# Altium schematic sheet MISC.SchDoc: Network Module
size 431 x 279 mm; DrawnBy: Bin Xiao; Organization: RYSE Inc.
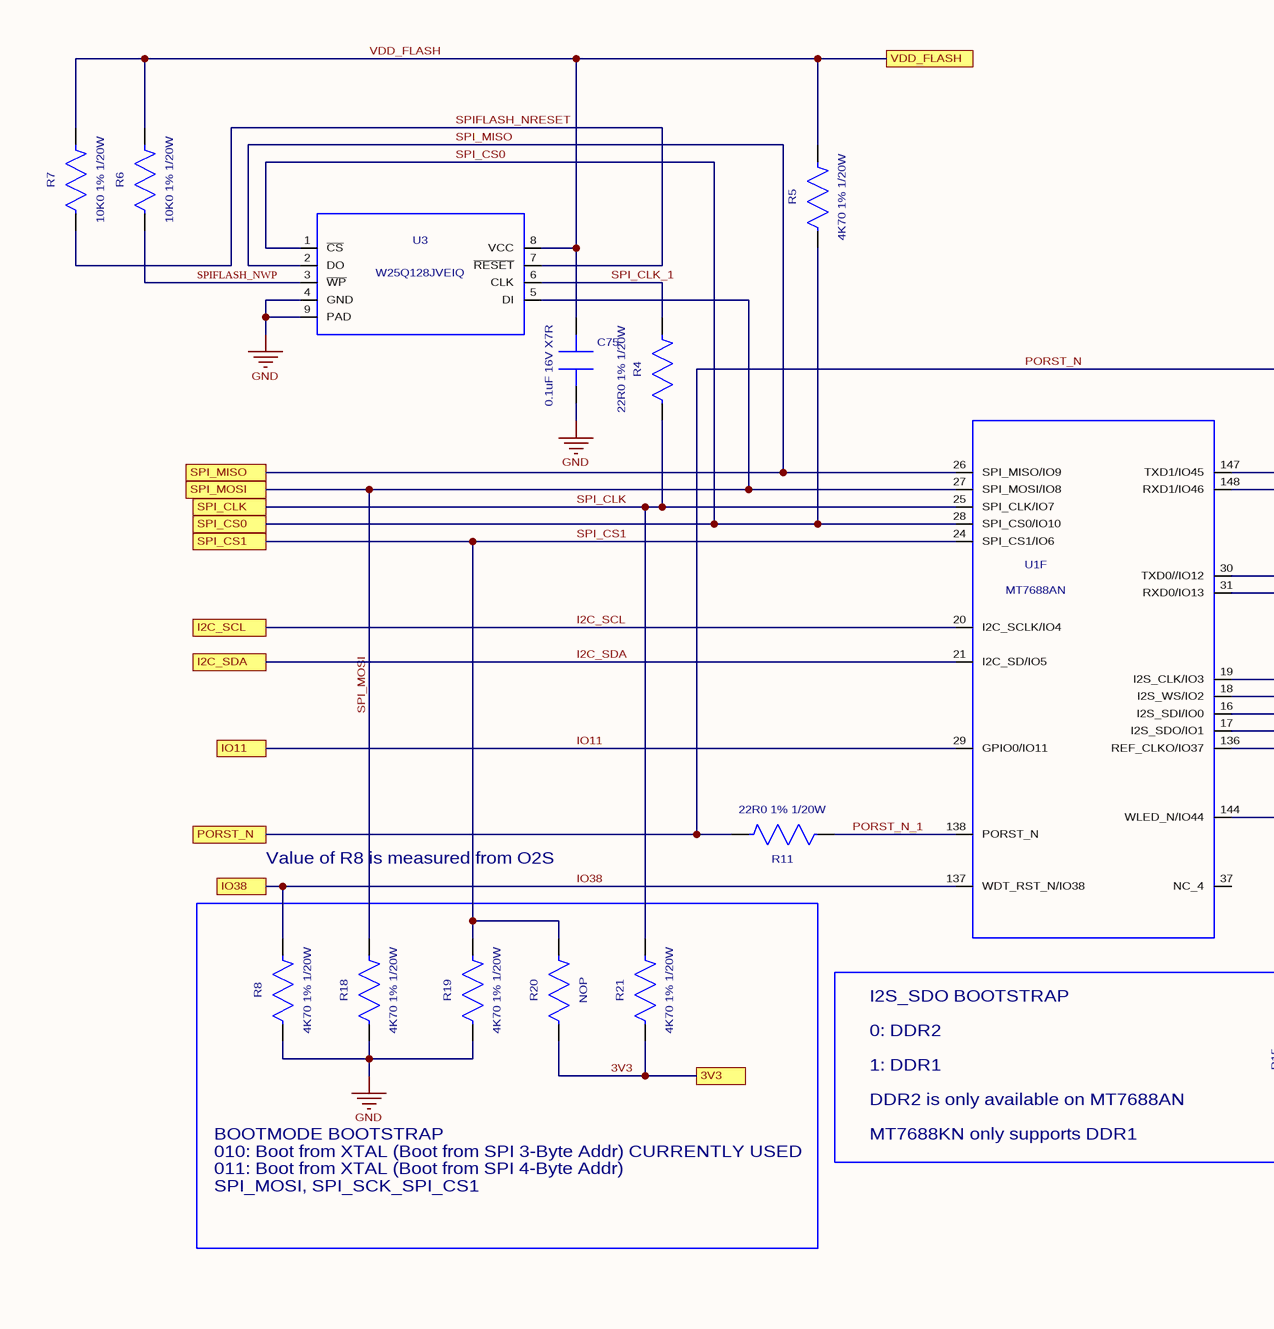
[diagram p0: MISC.SchDoc, left]
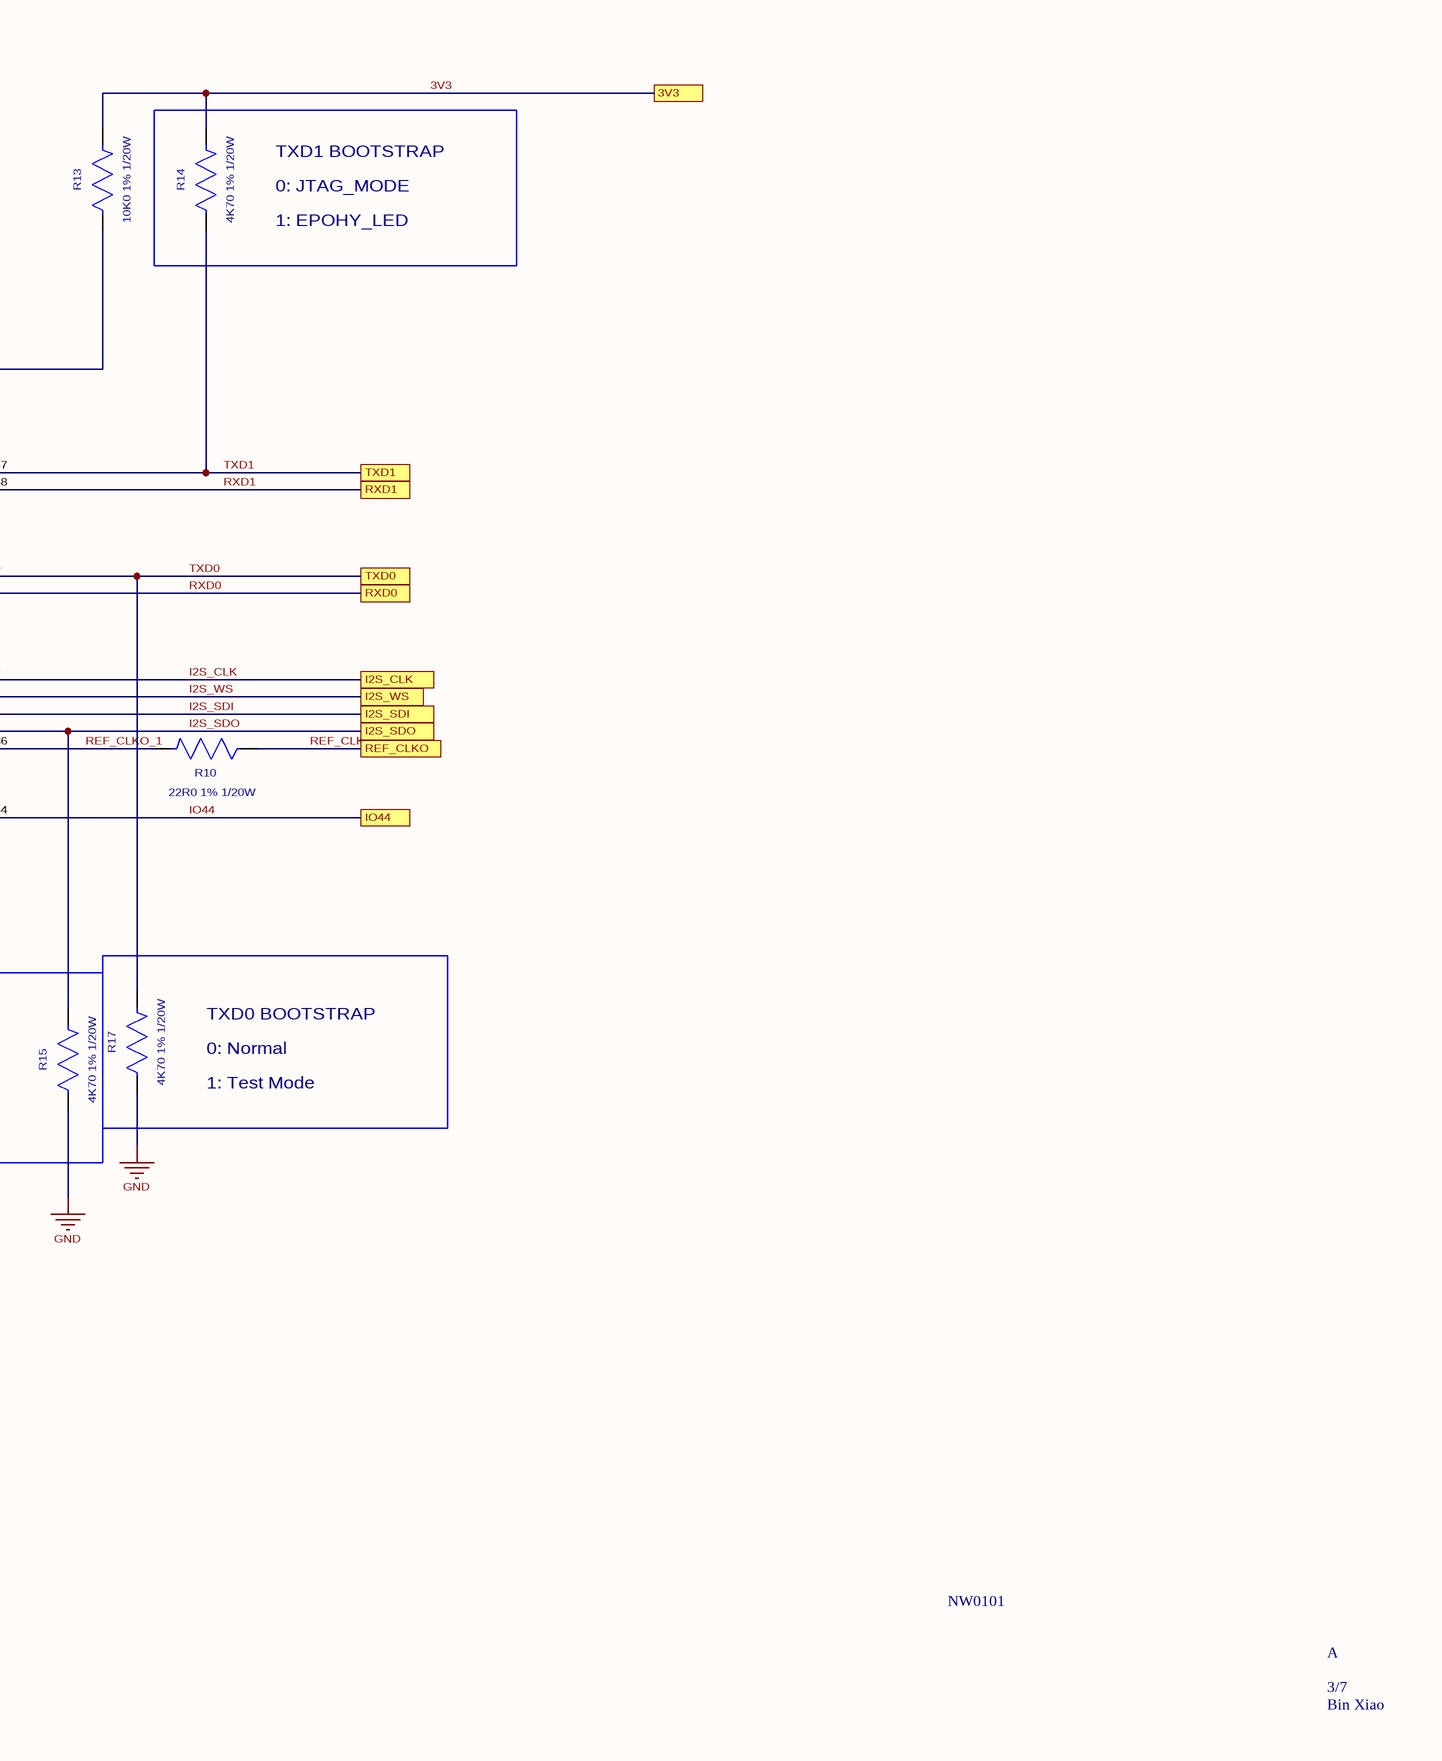
[diagram p1: MISC.SchDoc, right]

## Parts
C75  value 0.1uF 16V X7R  [C0201]  (hidden comment: CAP0201-104-16V-X7R)
R4  value 22R0 1% 1/20W  [R0201]  (hidden comment: RES0201-22R0)
R5  value 4K70 1% 1/20W  [R0201]  (hidden comment: RES0201-4K70)
R6  value 10K0 1% 1/20W  [R0201]  (hidden comment: RES0201-10K0)
R7  value 10K0 1% 1/20W  [R0201]  (hidden comment: RES0201-10K0)
R8  value 4K70 1% 1/20W  [R0201]  (hidden comment: RES0201-4K70)
R10  value 22R0 1% 1/20W  [R0201]  (hidden comment: RES0201-22R0)
R11  value 22R0 1% 1/20W  [R0201]  (hidden comment: RES0201-22R0)
R13  value 10K0 1% 1/20W  [R0201]  (hidden comment: RES0201-10K0)
R14  value 4K70 1% 1/20W  [R0201]  (hidden comment: RES0201-4K70)
R15  value 4K70 1% 1/20W  [R0201]  (hidden comment: RES0201-4K70)
R17  value 4K70 1% 1/20W  [R0201]  (hidden comment: RES0201-4K70)
R18  value 4K70 1% 1/20W  [R0201]  (hidden comment: RES0201-4K70)
R19  value 4K70 1% 1/20W  [R0201]  (hidden comment: RES0201-4K70)
R20  value NOP  [R0201_NOP]  (hidden comment: RES0201-NOP)
R21  value 4K70 1% 1/20W  [R0201]  (hidden comment: RES0201-4K70)
U1  MT7688AN  [DR-QFN-128]  (part F of 6)
U3  W25Q128JVEIQ  [WIN_E-8_WIN]

## Ports
3V3, I2C_SCL, I2C_SDA, I2S_CLK, I2S_SDI, I2S_SDO, I2S_WS, IO11, IO38, IO44, PORST_N, REF_CLKO, RXD0, RXD1, SPI_CLK, SPI_CS0, SPI_CS1, SPI_MISO, SPI_MOSI, TXD0, TXD1, VDD_FLASH

## Nets
GND: C75.2 R8.1 R15.1 R17.1 R18.1 R19.1 U3.4(GND) U3.9(PAD)
3V3: R13.2 R14.2 R20.1 R21.1 ; port 3V3
I2C_SCL: U1.20(I2C_SCLK/IO4) ; port I2C_SCL
I2C_SDA: U1.21(I2C_SD/IO5) ; port I2C_SDA
I2S_CLK: U1.19(I2S_CLK/IO3) ; port I2S_CLK
I2S_SDI: U1.16(I2S_SDI/IO0) ; port I2S_SDI
I2S_SDO: R15.2 U1.17(I2S_SDO/IO1) ; port I2S_SDO
I2S_WS: U1.18(I2S_WS/IO2) ; port I2S_WS
IO11: U1.29(GPIO0/IO11) ; port IO11
IO38: R8.2 U1.137(WDT_RST_N/IO38) ; port IO38
IO44: U1.144(WLED_N/IO44) ; port IO44
PORST_N: R11.2 R13.1 ; port PORST_N
PORST_N_1: R11.1 U1.138(PORST_N)
REF_CLKO: R10.1 ; port REF_CLKO
REF_CLKO_1: R10.2 U1.136(REF_CLKO/IO37)
RXD0: U1.31(RXD0/IO13) ; port RXD0
RXD1: U1.148(RXD1/IO46) ; port RXD1
SPI_CLK: R4.1 R21.2 U1.25(SPI_CLK/IO7) ; port SPI_CLK
SPI_CLK_1: R4.2 U3.6(CLK)
SPI_CS0: R5.1 U1.28(SPI_CS0/IO10) U3.1(~{CS}) ; port SPI_CS0
SPI_CS1: R19.2 R20.2 U1.24(SPI_CS1/IO6) ; port SPI_CS1
SPI_MISO: U1.26(SPI_MISO/IO9) U3.2(DO) ; port SPI_MISO
SPI_MOSI: R18.2 U1.27(SPI_MOSI/IO8) U3.5(DI) ; port SPI_MOSI
SPIFLASH_NRESET: R7.1 U3.7(~{RESET})
SPIFLASH_NWP: R6.1 U3.3(~{WP})
TXD0: R17.2 U1.30(TXD0//IO12) ; port TXD0
TXD1: R14.1 U1.147(TXD1/IO45) ; port TXD1
VDD_FLASH: C75.1 R5.2 R6.2 R7.2 U3.8(VCC) ; port VDD_FLASH

Not connected (* = marked no-connect by the designer): U1 37(NC_4)

## Notes on the sheet
- 0: JTAG_MODE
- 1: EPOHY_LED
- TXD1 BOOTSTRAP
- Value of R8 is measured from O2S
- I2S_SDO BOOTSTRAP
- 0: DDR2
- 1: DDR1
- TXD0 BOOTSTRAP
- 0: Normal
- 1: Test Mode
- 010: Boot from XTAL (Boot from SPI 3-Byte Addr) CURRENTLY USED
- BOOTMODE BOOTSTRAP
- 011: Boot from XTAL (Boot from SPI 4-Byte Addr)
- DDR2 is only available on MT7688AN
- MT7688KN only supports DDR1
- SPI_MOSI, SPI_SCK_SPI_CS1
- NW0101
- A
- 3/7
- Bin Xiao

## Library data of the parts
C75 = CAP0201-104-16V-X7R: CAP CER 0.1UF 16V X7R 0201; Part Number: GRM033Z71C104KE14D; Manufacturer: Murata Electronics; Prefered Vender: Digikey; Aligni Value: 0.1u; Type: Capacitor; Geometry.Height: 0.33mm; PCB DECAL: RC0201; Revision: A
R4 R10 R11 = RES0201-22R0: RES 22 OHM 1% 1/20W 0201; Manufacturer: Yageo; Part Number: RC0201FR-0722RL; Geometry.Height: 0.5mm; Prefered Vender: Digikey; Aligni Value: 22; PCB DECAL: RC0201; Type: Resistor; Revision: A
R5 R8 R14 R15 R17-R19 R21 = RES0201-4K70: RES 4.7K OHM 1% 1/20W 0201; Manufacturer: Yageo; Part Number: RC0201FR-074K7L; Geometry.Height: 0.5mm; Prefered Vender: Digikey; PCB DECAL: RC0201; Type: Resistor; Revision: A; Aligni Value: 4.7k
R6 R7 R13 = RES0201-10K0: RES SMD 10K OHM 1% 1/20W 0201; Manufacturer: Yageo; Part Number: RC0201FR-0710KP; Geometry.Height: 0.5mm; Prefered Vender: Digikey; PCB DECAL: RC0201; Type: Resistor; Revision: A; Aligni Value: 10k
R20 = RES0201-NOP: NOP; Geometry.Height: 0mm; PCB DECAL: RC0201; Manufacturer: NOP; Type: Resistor; Revision: A; Prefered Vender: NOP; Aligni Value: NOP; Part Number: NOP
U1 = MT7688AN: 580Mhz 32bits Networking Processor; Manufacturer: MediaTek Inc; Geometry.Height: 0mm; Type: IC; Part Number: MT7688AN; PCB DECAL: DR-QFN-128
U3 = W25Q128JVEIQ: IC FLASH 128MBIT SPI/QUAD 8WSON; Manufacturer: Winbond Electronics; Prefered Vender: Digikey; PCB DECAL: WIN_E-8_WIN; Type: IC; Part Number: W25Q128JVEIQ